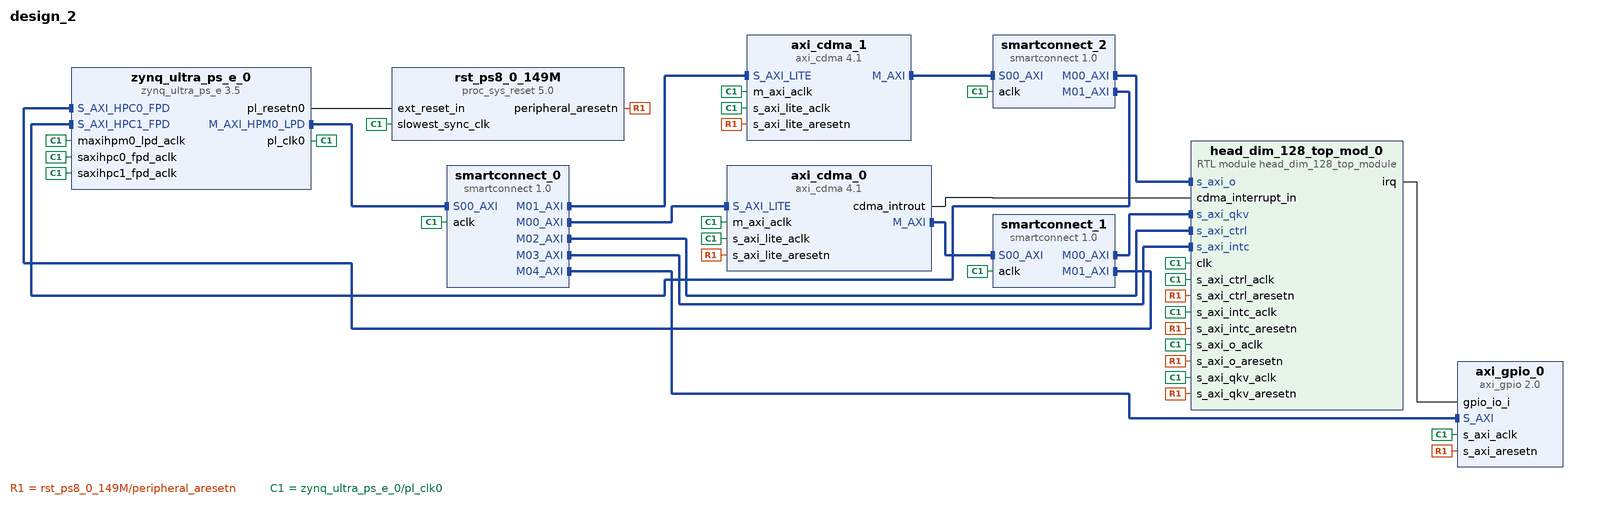
[diagram p0: block diagram of the top level]
# Vivado block design design_2, xczu9eg-ffvb1156-2-e, Vivado 2023.2
create_bd_design design_2

create_bd_cell -type module -reference head_dim_128_top_module head_dim_128_top_mod_0
create_bd_cell -type ip -vlnv xilinx.com:ip:zynq_ultra_ps_e:3.5 zynq_ultra_ps_e_0
set_property -dict [list \
  CONFIG.PSU__CRL_APB__PL0_REF_CTRL__FREQMHZ 150 \
  CONFIG.PSU__DDR_HIGH_ADDRESS_GUI_ENABLE 0 \
  CONFIG.PSU__USE__S_AXI_GP0 1 \
  CONFIG.PSU__USE__S_AXI_GP1 1 \
] [get_bd_cells zynq_ultra_ps_e_0]
# 30 more settings of zynq_ultra_ps_e_0 are not shown: defaults, MIO pin electricals, DDR timing, and values the tool derives
create_bd_cell -type ip -vlnv xilinx.com:ip:axi_cdma:4.1 axi_cdma_0
set_property -dict {CONFIG.C_INCLUDE_SG 0 CONFIG.C_M_AXI_DATA_WIDTH 32 CONFIG.C_M_AXI_MAX_BURST_LEN 16} [get_bd_cells axi_cdma_0]
create_bd_cell -type ip -vlnv xilinx.com:ip:axi_cdma:4.1 axi_cdma_1
set_property -dict {CONFIG.C_INCLUDE_SG 0 CONFIG.C_M_AXI_MAX_BURST_LEN 16} [get_bd_cells axi_cdma_1]
create_bd_cell -type ip -vlnv xilinx.com:ip:smartconnect:1.0 smartconnect_0
set_property -dict {CONFIG.NUM_MI 5 CONFIG.NUM_SI 1} [get_bd_cells smartconnect_0]
create_bd_cell -type ip -vlnv xilinx.com:ip:smartconnect:1.0 smartconnect_1
set_property -dict {CONFIG.NUM_MI 2 CONFIG.NUM_SI 1} [get_bd_cells smartconnect_1]
create_bd_cell -type ip -vlnv xilinx.com:ip:smartconnect:1.0 smartconnect_2
set_property -dict {CONFIG.NUM_MI 2 CONFIG.NUM_SI 1} [get_bd_cells smartconnect_2]
create_bd_cell -type ip -vlnv xilinx.com:ip:axi_gpio:2.0 axi_gpio_0
set_property -dict {CONFIG.C_ALL_INPUTS 1 CONFIG.C_GPIO_WIDTH 1} [get_bd_cells axi_gpio_0]
create_bd_cell -type ip -vlnv xilinx.com:ip:proc_sys_reset:5.0 rst_ps8_0_149M

# ---- connections ----

connect_bd_intf_net [get_bd_intf_pins axi_cdma_0/M_AXI] [get_bd_intf_pins smartconnect_1/S00_AXI]
connect_bd_intf_net [get_bd_intf_pins smartconnect_2/S00_AXI] [get_bd_intf_pins axi_cdma_1/M_AXI]
connect_bd_intf_net [get_bd_intf_pins smartconnect_0/M00_AXI] [get_bd_intf_pins axi_cdma_0/S_AXI_LITE]
connect_bd_intf_net [get_bd_intf_pins smartconnect_0/M01_AXI] [get_bd_intf_pins axi_cdma_1/S_AXI_LITE]
connect_bd_intf_net [get_bd_intf_pins smartconnect_0/M02_AXI] [get_bd_intf_pins head_dim_128_top_mod_0/s_axi_ctrl]
connect_bd_intf_net [get_bd_intf_pins smartconnect_0/M03_AXI] [get_bd_intf_pins head_dim_128_top_mod_0/s_axi_intc]
connect_bd_intf_net [get_bd_intf_pins smartconnect_0/M04_AXI] [get_bd_intf_pins axi_gpio_0/S_AXI]
connect_bd_intf_net [get_bd_intf_pins smartconnect_1/M00_AXI] [get_bd_intf_pins head_dim_128_top_mod_0/s_axi_qkv]
connect_bd_intf_net [get_bd_intf_pins smartconnect_1/M01_AXI] [get_bd_intf_pins zynq_ultra_ps_e_0/S_AXI_HPC0_FPD]
connect_bd_intf_net [get_bd_intf_pins head_dim_128_top_mod_0/s_axi_o] [get_bd_intf_pins smartconnect_2/M00_AXI]
connect_bd_intf_net [get_bd_intf_pins smartconnect_2/M01_AXI] [get_bd_intf_pins zynq_ultra_ps_e_0/S_AXI_HPC1_FPD]
connect_bd_intf_net [get_bd_intf_pins zynq_ultra_ps_e_0/M_AXI_HPM0_LPD] [get_bd_intf_pins smartconnect_0/S00_AXI]
connect_bd_net [get_bd_pins axi_cdma_0/cdma_introut] [get_bd_pins head_dim_128_top_mod_0/cdma_interrupt_in]
connect_bd_net [get_bd_pins head_dim_128_top_mod_0/irq] [get_bd_pins axi_gpio_0/gpio_io_i]
connect_bd_net [get_bd_pins rst_ps8_0_149M/peripheral_aresetn] \
  [get_bd_pins axi_cdma_0/s_axi_lite_aresetn] [get_bd_pins axi_cdma_1/s_axi_lite_aresetn] \
  [get_bd_pins axi_gpio_0/s_axi_aresetn] [get_bd_pins head_dim_128_top_mod_0/s_axi_qkv_aresetn] \
  [get_bd_pins head_dim_128_top_mod_0/s_axi_o_aresetn] [get_bd_pins head_dim_128_top_mod_0/s_axi_ctrl_aresetn] \
  [get_bd_pins head_dim_128_top_mod_0/s_axi_intc_aresetn]
connect_bd_net [get_bd_pins zynq_ultra_ps_e_0/pl_clk0] \
  [get_bd_pins axi_cdma_0/m_axi_aclk] [get_bd_pins smartconnect_1/aclk] [get_bd_pins axi_cdma_0/s_axi_lite_aclk] \
  [get_bd_pins smartconnect_0/aclk] [get_bd_pins rst_ps8_0_149M/slowest_sync_clk] [get_bd_pins axi_cdma_1/m_axi_aclk] \
  [get_bd_pins smartconnect_2/aclk] [get_bd_pins axi_cdma_1/s_axi_lite_aclk] [get_bd_pins axi_gpio_0/s_axi_aclk] \
  [get_bd_pins zynq_ultra_ps_e_0/maxihpm0_lpd_aclk] [get_bd_pins zynq_ultra_ps_e_0/saxihpc0_fpd_aclk] \
  [get_bd_pins zynq_ultra_ps_e_0/saxihpc1_fpd_aclk] [get_bd_pins head_dim_128_top_mod_0/s_axi_qkv_aclk] \
  [get_bd_pins head_dim_128_top_mod_0/s_axi_o_aclk] [get_bd_pins head_dim_128_top_mod_0/s_axi_ctrl_aclk] \
  [get_bd_pins head_dim_128_top_mod_0/s_axi_intc_aclk] [get_bd_pins head_dim_128_top_mod_0/clk]
connect_bd_net [get_bd_pins zynq_ultra_ps_e_0/pl_resetn0] [get_bd_pins rst_ps8_0_149M/ext_reset_in]

# ---- address map ----
assign_bd_address -offset 0x00000000 -range 2G -target_address_space [get_bd_addr_spaces axi_cdma_0/Data] [get_bd_addr_segs zynq_ultra_ps_e_0/SAXIGP0/HPC0_DDR_LOW]
assign_bd_address -offset 0x80000000 -range 2M -target_address_space [get_bd_addr_spaces axi_cdma_0/Data] [get_bd_addr_segs head_dim_128_top_mod_0/s_axi_qkv/reg0]
exclude_bd_addr_seg -offset 0xFF000000 -range 16M -target_address_space [get_bd_addr_spaces axi_cdma_0/Data] [get_bd_addr_segs zynq_ultra_ps_e_0/SAXIGP0/HPC0_LPS_OCM]
assign_bd_address -offset 0x00000000 -range 2G -target_address_space [get_bd_addr_spaces axi_cdma_1/Data] [get_bd_addr_segs zynq_ultra_ps_e_0/SAXIGP1/HPC1_DDR_LOW]
assign_bd_address -offset 0xC0000000 -range 256K -target_address_space [get_bd_addr_spaces axi_cdma_1/Data] [get_bd_addr_segs head_dim_128_top_mod_0/s_axi_o/reg0]
exclude_bd_addr_seg -offset 0xFF000000 -range 16M -target_address_space [get_bd_addr_spaces axi_cdma_1/Data] [get_bd_addr_segs zynq_ultra_ps_e_0/SAXIGP1/HPC1_LPS_OCM]
assign_bd_address -offset 0x0080000000 -range 64K -target_address_space [get_bd_addr_spaces zynq_ultra_ps_e_0/Data] [get_bd_addr_segs axi_cdma_0/S_AXI_LITE/Reg]
assign_bd_address -offset 0x0080010000 -range 64K -target_address_space [get_bd_addr_spaces zynq_ultra_ps_e_0/Data] [get_bd_addr_segs axi_cdma_1/S_AXI_LITE/Reg]
assign_bd_address -offset 0x0080020000 -range 64K -target_address_space [get_bd_addr_spaces zynq_ultra_ps_e_0/Data] [get_bd_addr_segs axi_gpio_0/S_AXI/Reg]
assign_bd_address -offset 0x0080030000 -range 4K -target_address_space [get_bd_addr_spaces zynq_ultra_ps_e_0/Data] [get_bd_addr_segs head_dim_128_top_mod_0/s_axi_ctrl/reg0]
assign_bd_address -offset 0x0080031000 -range 4K -target_address_space [get_bd_addr_spaces zynq_ultra_ps_e_0/Data] [get_bd_addr_segs head_dim_128_top_mod_0/s_axi_intc/reg0]

validate_bd_design
save_bd_design
